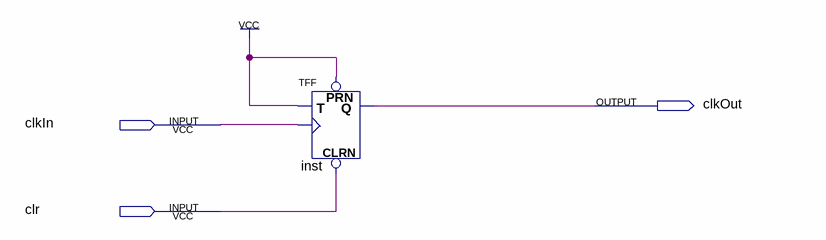
[diagram p0: schematic sheet]
// Quartus schematic clkHalf.bdf as structural Verilog: 1 symbols, 3 pins
module clkHalf (
  input  clkIn,
  input  clr,
  output clkOut
);

  TFF inst (.PRN(1'b1), .CLRN(clr), .T(1'b1), .CLK(clkIn), .Q(clkOut));
endmodule
